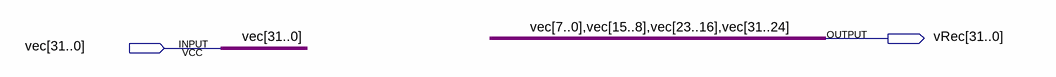
[diagram p0: schematic sheet]
// Quartus schematic LBE.bdf as structural Verilog: 0 symbols, 2 pins
module LBE (
  input  [31:0] vec,
  output [31:0] vRec
);


  assign vRec = {vec[7:0], vec[15:8], vec[23:16], vec[31:24]};
endmodule
